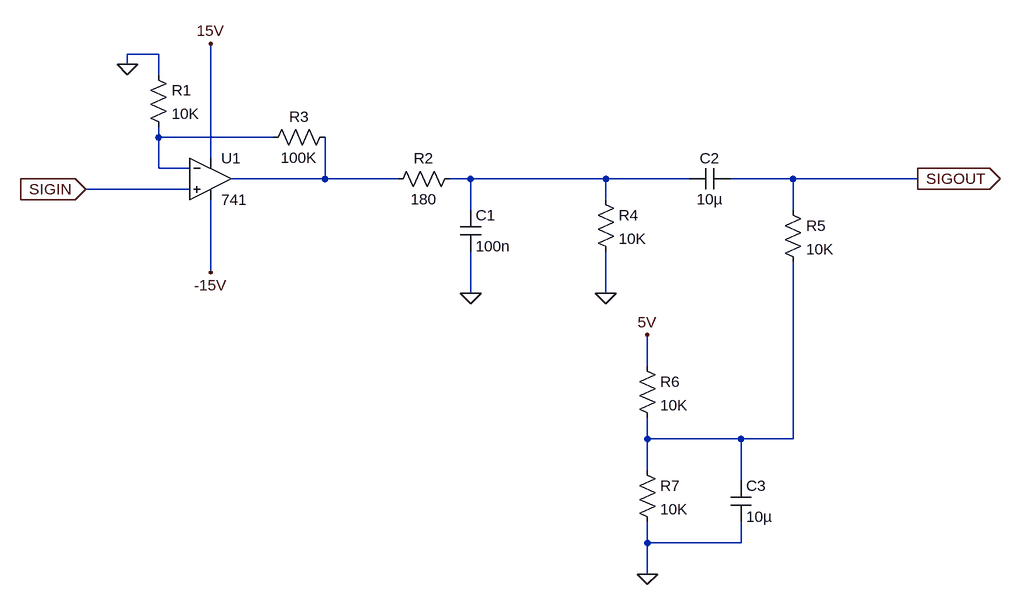
[diagram p0: schematic InputCircuit.asc]
InputCircuit.asc, the LTspice schematic file:
Version 4
SHEET 1 1460 692
WIRE 128 -128 80 -128
WIRE 80 -112 80 -128
WIRE 128 -96 128 -128
WIRE 128 0 128 -16
WIRE 304 0 128 0
WIRE 208 32 208 -144
WIRE 128 48 128 0
WIRE 176 48 128 48
WIRE 384 64 384 0
WIRE 384 64 240 64
WIRE 496 64 384 64
WIRE 608 64 576 64
WIRE 816 64 608 64
WIRE 944 64 816 64
WIRE 1104 64 1008 64
WIRE 1296 64 1104 64
WIRE 176 80 16 80
WIRE 816 96 816 64
WIRE 608 112 608 64
WIRE 1104 112 1104 64
WIRE 208 208 208 96
WIRE 608 240 608 176
WIRE 816 240 816 176
WIRE 880 352 880 304
WIRE 880 464 880 432
WIRE 1024 464 880 464
WIRE 1104 464 1104 192
WIRE 1104 464 1024 464
WIRE 880 512 880 464
WIRE 1024 528 1024 464
WIRE 880 624 880 592
WIRE 1024 624 1024 592
WIRE 1024 624 880 624
WIRE 880 672 880 624
FLAG 16 80 SIGIN
IOPIN 16 80 In
FLAG 80 -112 0
FLAG 208 -144 15V
FLAG 208 208 -15V
FLAG 608 240 0
FLAG 816 240 0
FLAG 880 304 5V
FLAG 880 672 0
FLAG 1296 64 SIGOUT
IOPIN 1296 64 Out
SYMBOL res 592 48 R90
WINDOW 0 0 56 VBottom 2
WINDOW 3 32 56 VTop 2
SYMATTR InstName R2
SYMATTR Value 180
SYMBOL cap 592 112 R0
SYMATTR InstName C1
SYMATTR Value 100n
SYMBOL opamp2 208 0 R0
SYMATTR InstName U1
SYMATTR Value 741
SYMBOL res 112 -112 R0
SYMATTR InstName R1
SYMATTR Value 10K
SYMBOL res 400 -16 R90
WINDOW 0 0 56 VBottom 2
WINDOW 3 32 56 VTop 2
SYMATTR InstName R3
SYMATTR Value 100K
SYMBOL res 800 80 R0
SYMATTR InstName R4
SYMATTR Value 10K
SYMBOL cap 1008 48 R90
WINDOW 0 0 32 VBottom 2
WINDOW 3 32 32 VTop 2
SYMATTR InstName C2
SYMATTR Value 10µ
SYMBOL res 1088 96 R0
SYMATTR InstName R5
SYMATTR Value 10K
SYMBOL res 864 336 R0
SYMATTR InstName R6
SYMATTR Value 10K
SYMBOL res 864 496 R0
SYMATTR InstName R7
SYMATTR Value 10K
SYMBOL cap 1008 528 R0
SYMATTR InstName C3
SYMATTR Value 10µ

The netlist it stands for:
* InputCircuit.asc
R2 N003 N002 180
C1 N003 0 100n
XU1 SIGIN N001 15V -15V N002 741  ; pins In+ In- V+ V- OUT
R1 0 N001 10K
R3 N002 N001 100K
R4 N003 0 10K
C2 SIGOUT N003 10µ
R5 SIGOUT N004 10K
R6 5V N004 10K
R7 N004 0 10K
C3 N004 0 10µ
.backanno
.end